# EAGLE design 2018_Dashboard (EAGLE 8.6.1)
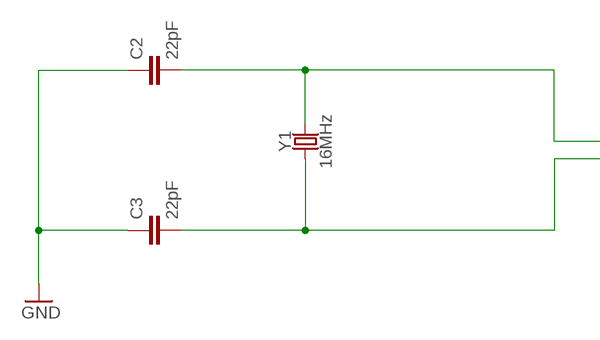
[diagram p0: schematic, sheet 1, part 1 of 2]
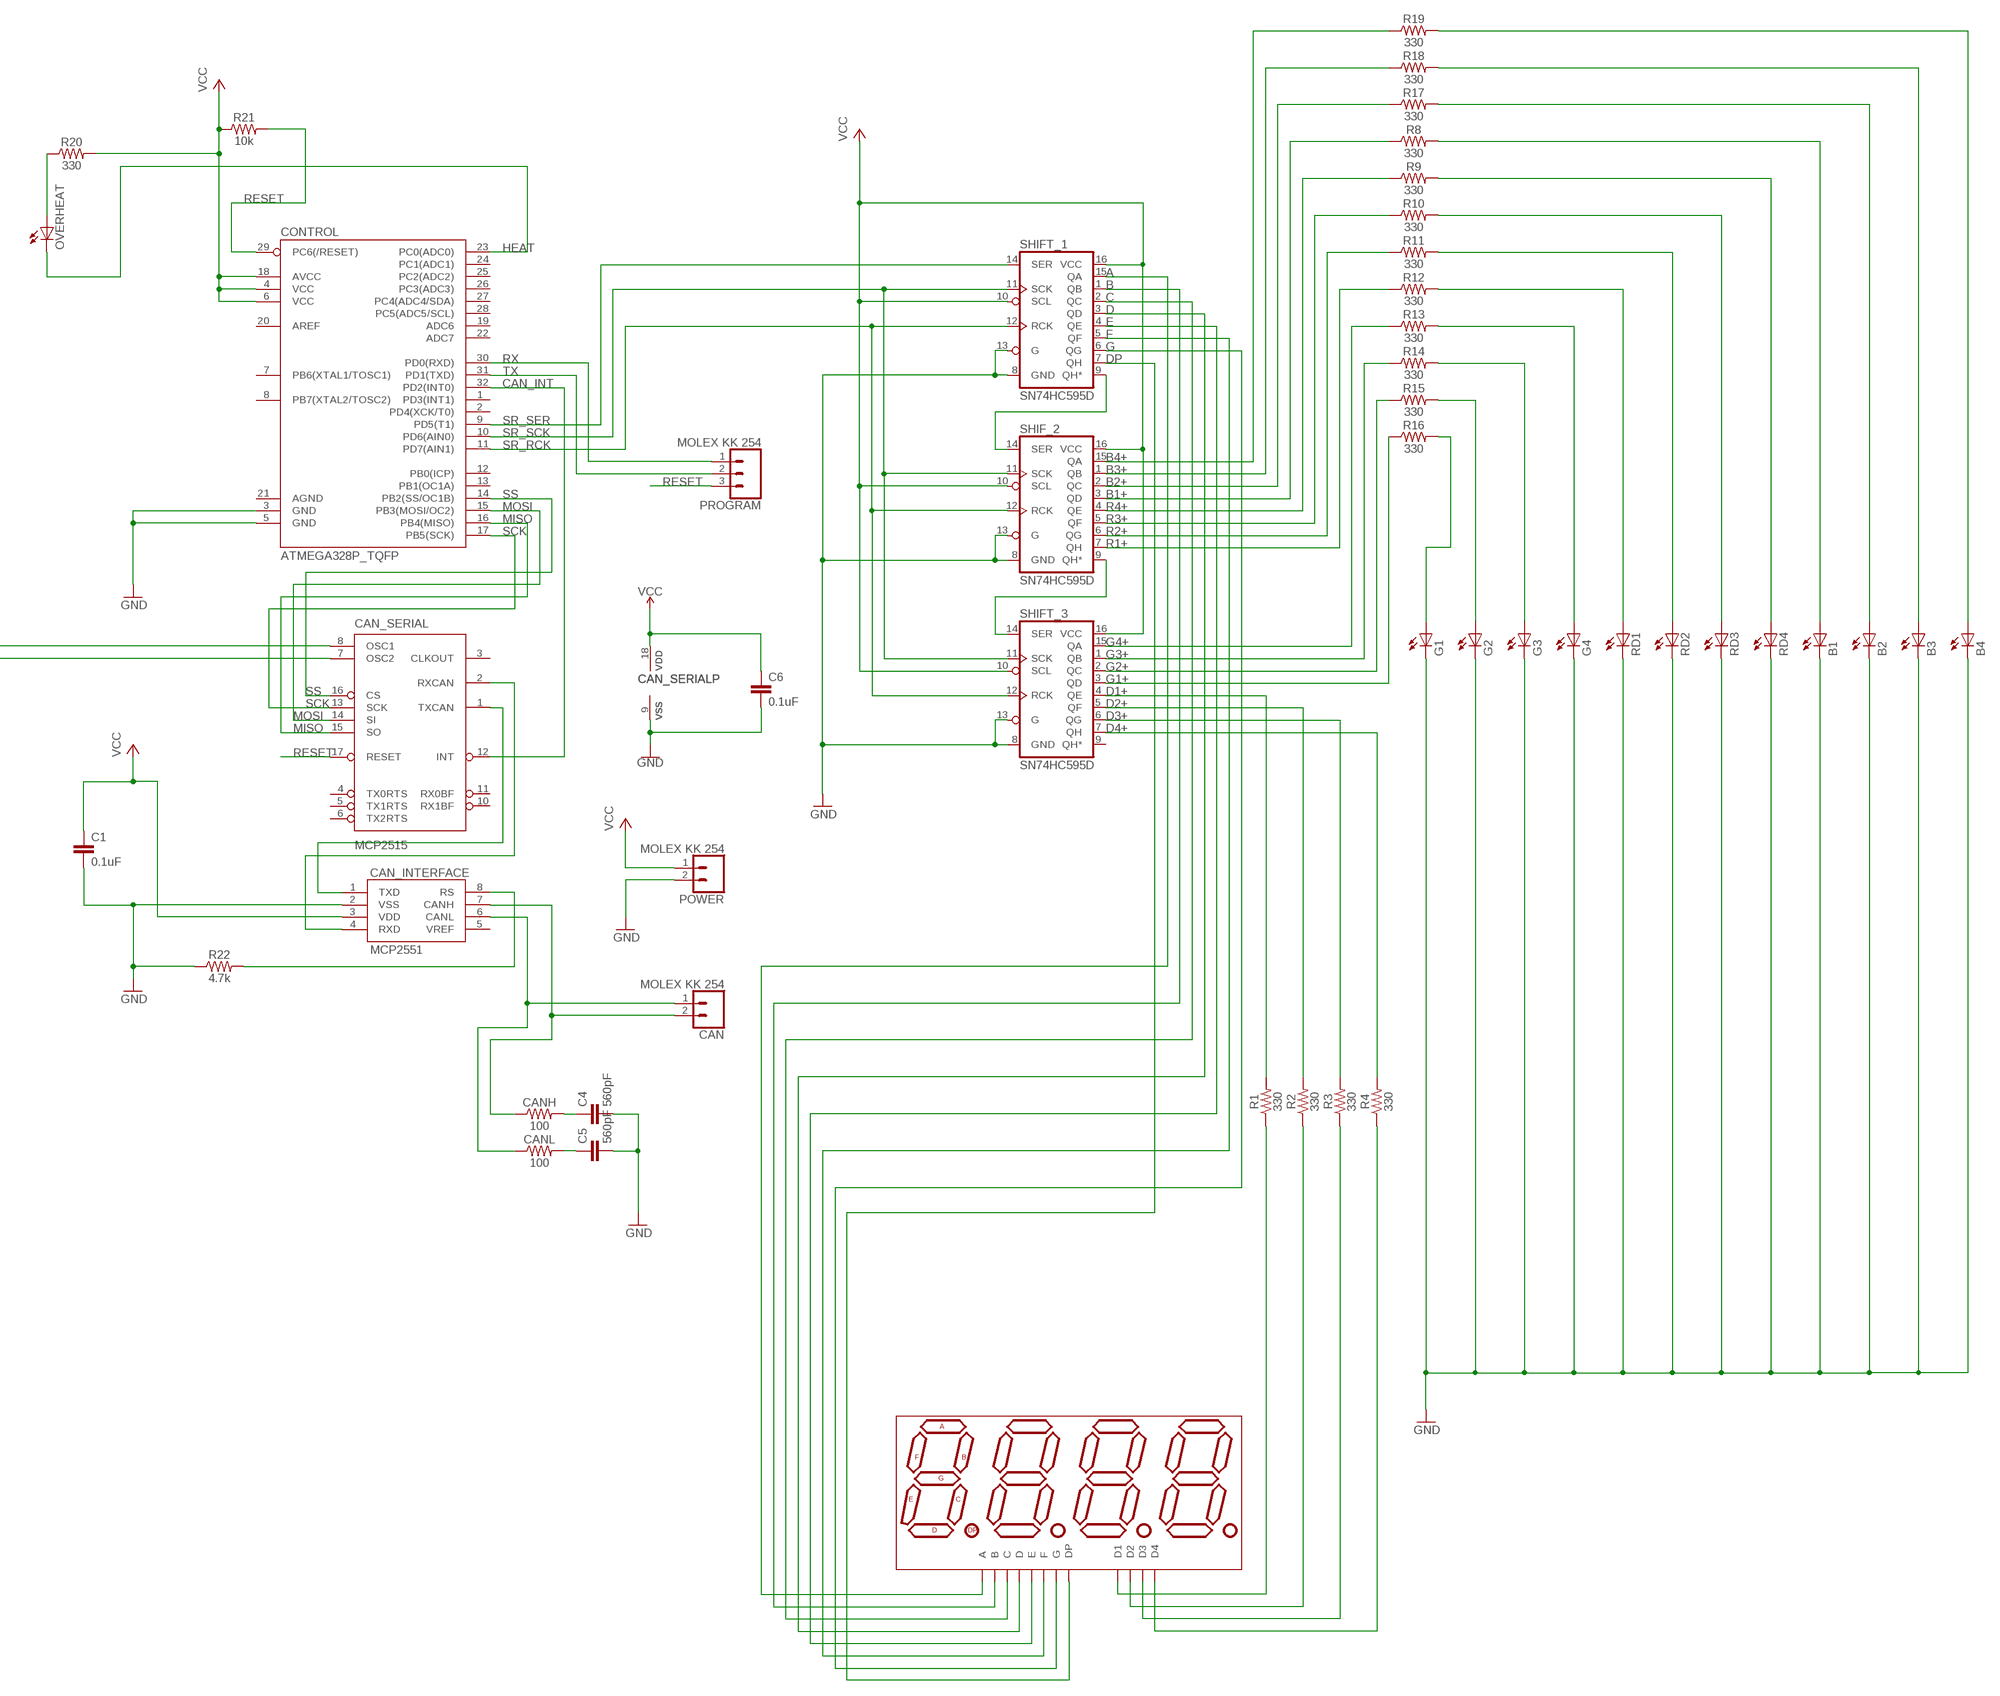
[diagram p1: schematic, sheet 1, part 2 of 2]

## Parts
B1  TLLG4400  [LED3MM]
B2  TLLG4400  [LED3MM]
B3  TLLG4400  [LED3MM]
B4  TLLG4400  [LED3MM]
C1  0.1uF  0.1UF-0603-25V-(+80/-20%)  [0603]
C2  22pF  22PF-0603-50V-5%  [0603]
C3  22pF  22PF-0603-50V-5%  [0603]
C4  560pF  560PF-0603-50V-5%  [0603]
C5  560pF  560PF-0603-50V-5%  [0603]
C6  0.1uF  0.1UF-0402-16V-10%  [0402]
CAN  MOLEX KK 254  CONN_02  [1X02]
CAN_INTERFACE  MCP2551  [SO08]
CAN_SERIAL  MCP2515  MCP2515(MCP2510)SO  [SO18W]
CANH  100  100OHM-0603-1/4W-5%  [0603]
CANL  100  100OHM-0603-1/4W-5%  [0603]
CONTROL  ATMEGA328P_TQFP  [TQFP32-08]
G1  TLLG4400  [LED3MM]
G2  TLLG4400  [LED3MM]
G3  TLLG4400  [LED3MM]
G4  TLLG4400  [LED3MM]
OVERHEAT  TLLG4400  [LED3MM]
POWER  MOLEX KK 254  CONN_02  [1X02]
PROGRAM  MOLEX KK 254  CONN_03  [1X03]
R1  330  330OHM-0603-1/10W-1%  [0603]
R2  330  330OHM-0603-1/10W-1%  [0603]
R3  330  330OHM-0603-1/10W-1%  [0603]
R4  330  330OHM-0603-1/10W-1%  [0603]
R8  330  330OHM-0603-1/10W-1%  [0603]
R9  330  330OHM-0603-1/10W-1%  [0603]
R10  330  330OHM-0603-1/10W-1%  [0603]
R11  330  330OHM-0603-1/10W-1%  [0603]
R12  330  330OHM-0603-1/10W-1%  [0603]
R13  330  330OHM-0603-1/10W-1%  [0603]
R14  330  330OHM-0603-1/10W-1%  [0603]
R15  330  330OHM-0603-1/10W-1%  [0603]
R16  330  330OHM-0603-1/10W-1%  [0603]
R17  330  330OHM-0603-1/10W-1%  [0603]
R18  330  330OHM-0603-1/10W-1%  [0603]
R19  330  330OHM-0603-1/10W-1%  [0603]
R20  330  330OHM-0603-1/10W-1%  [0603]
R21  10k  10KOHM-0603-1/10W-1%  [0603]
R22  4.7k  4.7KOHM-0603-1/10W-1%  [0603]
RD1  TLLG4400  [LED3MM]
RD2  TLLG4400  [LED3MM]
RD3  TLLG4400  [LED3MM]
RD4  TLLG4400  [LED3MM]
SEVEN_SEGMENT  ATA8041AB  7-SEGMENT-4DIGIT-20MM-BLUE  [7-SEGMENT-4DIGIT-20MM]
SHIF_2  SN74HC595D  74HC595D  [SO16]
SHIFT_1  SN74HC595D  74HC595D  [SO16]
SHIFT_3  SN74HC595D  74HC595D  [SO16]
Y1  16MHz  CRYSTAL-16MHZPTH-HC49US  [HC49US]

## Nets
A: SEVEN_SEGMENT.11(A) SHIFT_1.15(QA)
B: SEVEN_SEGMENT.7(B) SHIFT_1.1(QB)
B1: B1.A R8.2
B1+: R8.1 SHIF_2.3(QD)
B2: B2.A R17.2
B2+: R17.1 SHIF_2.2(QC)
B3: B3.A R18.2
B3+: R18.1 SHIF_2.1(QB)
B4: B4.A R19.2
B4+: R19.1 SHIF_2.15(QA)
C: SEVEN_SEGMENT.4(C) SHIFT_1.2(QC)
CAN_INT: CAN_SERIAL.12(INT) CONTROL.32(PD2(INT0))
CANH: CAN.2 CAN_INTERFACE.7(CANH) CANH.1
CANL: CAN.1 CAN_INTERFACE.6(CANL) CANL.1
CARRY1: SHIF_2.14(SER) SHIFT_1.9(QH*)
CARRY2: SHIF_2.9(QH*) SHIFT_3.14(SER)
CHI: C4.1 CANH.2
CI_SLOPE: CAN_INTERFACE.8(RS) R22.2
CLI: C5.1 CANL.2
D: SEVEN_SEGMENT.2(D) SHIFT_1.3(QD)
D1: R1.1 SEVEN_SEGMENT.12(D1)
D1+: R1.2 SHIFT_3.4(QE)
D2: R2.1 SEVEN_SEGMENT.9(D2)
D2+: R2.2 SHIFT_3.5(QF)
D3: R3.1 SEVEN_SEGMENT.8(D3)
D3+: R3.2 SHIFT_3.6(QG)
D4: R4.1 SEVEN_SEGMENT.6(D4)
D4+: R4.2 SHIFT_3.7(QH)
DP: SEVEN_SEGMENT.3(DP) SHIFT_1.7(QH)
E: SEVEN_SEGMENT.1(E) SHIFT_1.4(QE)
F: SEVEN_SEGMENT.10(F) SHIFT_1.5(QF)
G: SEVEN_SEGMENT.5(G) SHIFT_1.6(QG)
G1: G1.A R16.2
G1+: R16.1 SHIFT_3.3(QD)
G2: G2.A R15.2
G2+: R15.1 SHIFT_3.2(QC)
G3: G3.A R14.2
G3+: R14.1 SHIFT_3.1(QB)
G4: G4.A R13.2
G4+: R13.1 SHIFT_3.15(QA)
GND: B1.K(C) B2.K(C) B3.K(C) B4.K(C) C1.2 C2.1 C3.1 C4.2 C5.2 C6.2 CAN_INTERFACE.2(VSS) CAN_SERIAL.9(VSS) CONTROL.3(GND) CONTROL.5(GND) G1.K(C) G2.K(C) G3.K(C) G4.K(C) POWER.2 R22.1 RD1.K(C) RD2.K(C) RD3.K(C) RD4.K(C) SHIF_2.8(GND) SHIF_2.13(G) SHIFT_1.8(GND) SHIFT_1.13(G) SHIFT_3.8(GND) SHIFT_3.13(G)
HEAT: CONTROL.23(PC0(ADC0)) OVERHEAT.K(C)
HEAT+: OVERHEAT.A R20.1
MISO: CAN_SERIAL.15(SO) CONTROL.16(PB4(MISO))
MOSI: CAN_SERIAL.14(SI) CONTROL.15(PB3(MOSI/OC2))
N$57: CAN_INTERFACE.1(TXD) CAN_SERIAL.1(TXCAN)
N$58: CAN_INTERFACE.4(RXD) CAN_SERIAL.2(RXCAN)
OSC1: C2.2 CAN_SERIAL.8(OSC1) Y1.2
OSC2: C3.2 CAN_SERIAL.7(OSC2) Y1.1
R1: R12.2 RD1.A
R1+: R12.1 SHIF_2.7(QH)
R2: R11.2 RD2.A
R2+: R11.1 SHIF_2.6(QG)
R3: R10.2 RD3.A
R3+: R10.1 SHIF_2.5(QF)
R4: R9.2 RD4.A
R4+: R9.1 SHIF_2.4(QE)
RESET: CAN_SERIAL.17(RESET) CONTROL.29(PC6(/RESET)) PROGRAM.3 R21.2
RX: CONTROL.30(PD0(RXD)) PROGRAM.1
SCK: CAN_SERIAL.13(SCK) CONTROL.17(PB5(SCK))
SR_RCK: CONTROL.11(PD7(AIN1)) SHIF_2.12(RCK) SHIFT_1.12(RCK) SHIFT_3.12(RCK)
SR_SCK: CONTROL.10(PD6(AIN0)) SHIF_2.11(SCK) SHIFT_1.11(SCK) SHIFT_3.11(SCK)
SR_SER: CONTROL.9(PD5(T1)) SHIFT_1.14(SER)
SS: CAN_SERIAL.16(CS) CONTROL.14(PB2(SS/OC1B))
TX: CONTROL.31(PD1(TXD)) PROGRAM.2
VCC: C1.1 C6.1 CAN_INTERFACE.3(VDD) CAN_SERIAL.18(VDD) CONTROL.4(VCC) CONTROL.6(VCC) CONTROL.18(AVCC) POWER.1 R20.2 R21.1 SHIF_2.10(SCL) SHIF_2.16(VCC) SHIFT_1.10(SCL) SHIFT_1.16(VCC) SHIFT_3.10(SCL) SHIFT_3.16(VCC)
Unconnected: CAN_INTERFACE.5(VREF) CAN_SERIAL.3(CLKOUT) CAN_SERIAL.4(TX0RTS) CAN_SERIAL.5(TX1RTS) CAN_SERIAL.6(TX2RTS) CAN_SERIAL.10(RX1BF) CAN_SERIAL.11(RX0BF) CONTROL.1(PD3(INT1)) CONTROL.2(PD4(XCK/T0)) CONTROL.7(PB6(XTAL1/TOSC1)) CONTROL.8(PB7(XTAL2/TOSC2)) CONTROL.12(PB0(ICP)) CONTROL.13(PB1(OC1A)) CONTROL.19(ADC6) CONTROL.20(AREF) CONTROL.21(AGND) CONTROL.22(ADC7) CONTROL.24(PC1(ADC1)) CONTROL.25(PC2(ADC2)) CONTROL.26(PC3(ADC3)) CONTROL.27(PC4(ADC4/SDA)) CONTROL.28(PC5(ADC5/SCL)) SHIFT_3.9(QH*)

## Library data of the parts
B1-B4 G1-G4 OVERHEAT RD1-RD4 = led:TLLG4400: Low Current (2mA) LED 3 mm Tinted Diffused Package color GREEN Source: Data sheet <http://www.farnell.com/datasheets/391098.pdf>; MF: VISHAY SEMICONDUCTOR; OC_FARNELL: 1612435
C1 = SparkFun-Capacitors:0.1UF: 0.1µF ceramic capacitors A capacitor is a passive two-terminal electrical component used to store electrical energy temporarily in an electric field.; PROD_ID: CAP-00810
C2 C3 = SparkFun-Capacitors:22PF: 22pF ceramic capacitors A capacitor is a passive two-terminal electrical component used to store electrical energy temporarily in an electric field.; PROD_ID: CAP-07876
C4 C5 = SparkFun-Capacitors:560PF: 0.56nF/560pF ceramic capacitors A capacitor is a passive two-terminal electrical component used to store electrical energy temporarily in an electric field.; PROD_ID: CAP-08749
C6 = SparkFun-Capacitors:0.1UF: 0.1µF ceramic capacitors A capacitor is a passive two-terminal electrical component used to store electrical energy temporarily in an electric field.; PROD_ID: CAP-12416
CAN POWER = SparkFun-Connectors:CONN_02: Multi connection point. Often used as Generic Header-pin footprint for 0.1 inch spaced/style header connections On any of the 0.1 inch spaced packages, you can populate with these: Break Away Headers - Straight <https://www.sparkfun.com/products/116> (PRT-00116) Break Away Male Headers - Right Angle <https://www.sparkfun.com/products/553> (PRT-00553) Female Headers <https://www.sparkfun.com/products/115> (PRT-00115) Break Away Headers - Machine Pin <https://www.sparkfun.com/products/117> (PRT-00117) Break Away Female Headers - Swiss Machine Pin <https://www.sparkfun.com/products/743> (PRT-00743) For SCREWTERMINALS and SPRING TERMINALS visit here: Screw Terimnals on SparkFun.com <https://www.sparkfun.com/search/results?term=Screw+Terminals> (5mm/3.5mm/2.54mm spacing) This device is also useful as a general connection point to wire up your design to another part of your project. Our various solder wires solder well into these plated through hole pads. Hook-Up Wire - Assortment (Stranded, 22 AWG) <https://www.sparkfun.com/products/11375> (PRT-11375) Hook-Up Wire - Assortment (Solid Core, 22 AWG) <https://www.sparkfun.com/products/11367> (PRT-11367) View the entire wire category on our website here <https://www.sparkfun.com/categories/141> Special notes: Molex polarized connector foot print use with: PRT-08233 with associated crimp pins and housings. 2.54_SCREWTERM for use with PRT-10571. 3.5mm Screw Terminal footprints for PRT-08084 5mm Screw Terminal footprints for use with PRT-08432
CAN_INTERFACE = SparkFun-IC-Comms:MCP2551: MCP2551 High Speed CAN Transceiver High speed CAN transceiver Datasheet <http://www.sparkfun.com/datasheets/DevTools/Arduino/MCP2551.pdf> SparkFun Products CAN-BUS Shield <https://www.sparkfun.com/products/13262> (DEV-13262) SparkFun OBD-II UART <https://www.sparkfun.com/products/9555> (WIG-09555); PROD_ID: IC-09907
CAN_SERIAL = SparkFun-IC-Comms:MCP2515(MCP2510): CAN controller with SPI interface The MCP2515 controller supercedes the MCP2510 while addressing all errata associated with it. The two devices are pin compatible, either can be used with this device. 18-pin package SOIC Simple SPI interface to any MCU. One-shot mode ensures message transmission is attempted only once Databyte filtering Start-of-Frame (SOF) output Low-power CMOS Technology Datasheet <http://www.sparkfun.com/datasheets/DevTools/Arduino/MCP2515.pdf> SparkFun Products CAN-BUS Shield <https://www.sparkfun.com/products/13262> (DEV-13262); PROD_ID: IC-09906
CANH CANL = SparkFun-Resistors:100OHM: 100Ω resistor A resistor is a passive two-terminal electrical component that implements electrical resistance as a circuit element. Resistors act to reduce current flow, and, at the same time, act to lower voltage levels within circuits. - Wikipedia; PROD_ID: RES-12438
CONTROL = SparkFun-IC-Microcontroller:ATMEGA328P_TQFP: Popular 328P in QFP Storefront component: ATmega328 - TQFP <https://www.sparkfun.com/products/13448> (COM-13448) Datasheet <http://www.sparkfun.com/datasheets/Components/SMD/ATMega328.pdf> SparkFun Products SparkFun RedBoard - Programmed with Arduino <https://www.sparkfun.com/products/12757> (DEV-12757) Arduino Pro Mini 328 - 5V/16MHz <https://www.sparkfun.com/products/11113> (DEV-11113) Arduino Pro Mini 328 - 3.3V/8MHz <https://www.sparkfun.com/products/11114> (DEV-11114) SparkFun OpenLog <https://www.sparkfun.com/products/13712> (DEV-13712) SparkFun MicroView - OLED Arduino Module <https://www.sparkfun.com/products/12923> (DEV-12923) SparkFun Digital Sandbox <https://www.sparkfun.com/products/12651> (DEV-12651) SparkFun PicoBoard <https://www.sparkfun.com/products/11888> (WIG-11888) Arduino Fio <https://www.sparkfun.com/products/10116> (DEV-10116) LilyPad Arduino 328 Main Board <https://www.sparkfun.com/products/13342> (DEV-13342) SparkFun RedStick <https://www.sparkfun.com/products/13741> (DEV-13741) LilyPad MP3 <https://www.sparkfun.com/products/11013> (DEV-11013) LilyPad Arduino SimpleSnap <https://www.sparkfun.com/products/10941> (DEV-10941) SparkFun Stepoko <https://www.sparkfun.com/products/13899> (ROB-13899) SparkFun Geiger Counter <https://www.sparkfun.com/products/11345> (SEN-11345) SparkFun EL Sequencer <https://www.sparkfun.com/products/12781> (COM-12781) Arduino Pro 328 - 5V/16MHz <https://www.sparkfun.com/products/10915> (DEV-10915) CryptoCape <https://www.sparkfun.com/products/12773> (DEV-12773) SparkFun IR Thermometer Evaluation Board - MLX90614 <https://www.sparkfun.com/products/10740> (SEN-10740) SparkFun RedBot Mainboard <https://www.sparkfun.com/products/12097> (ROB-12097) Arduino Pro 328 - 3.3V/8MHz <https://www.sparkfun.com/products/10914> (DEV-10914) SparkFun Block for Intel® Edison - Arduino <https://www.sparkfun.com/products/13036> (DEV-13036) SparkFun Simon Says - Surface Mount Soldering Kit <https://www.sparkfun.com/products/10935> (KIT-10935) SparkFun 7-Segment Serial Display - Red <https://www.sparkfun.com/products/11441> (COM-11441) SparkFun 7-Segment Serial Display - White <https://www.sparkfun.com/products/11629> (COM-11629) SparkFun 7-Segment Serial Display - Yellow <https://www.sparkfun.com/products/11443> (COM-11443) SparkFun 7-Segment Serial Display - Kelly Green <https://www.sparkfun.com/products/11440> (COM-11440) SparkFun 7-Segment Serial Display - Blue <https://www.sparkfun.com/products/11442> (COM-11442) SparkFun OpenSegment Serial Display - 20mm (Blue) <https://www.sparkfun.com/products/11647> (COM-11647) SparkFun OpenSegment Serial Display - 20mm (Green) <https://www.sparkfun.com/products/11646> (COM-11646) SparkFun OpenSegment Serial Display - 20mm (White) <https://www.sparkfun.com/products/11648> (COM-11648) SparkFun OpenSegment Serial Display - 20mm (Red) <https://www.sparkfun.com/products/11644> (COM-11644) SparkFun OpenSegment Serial Display - 20mm (Yellow) <https://www.sparkfun.com/products/11645> (COM-11645) SparkFun OpenSegment Shield <https://www.sparkfun.com/products/13190> (DEV-13190); PROD_ID: IC-09069
PROGRAM = SparkFun-Connectors:CONN_03: Multi connection point. Often used as Generic Header-pin footprint for 0.1 inch spaced/style header connections On any of the 0.1 inch spaced packages, you can populate with these: Break Away Headers - Straight <https://www.sparkfun.com/products/116> (PRT-00116) Break Away Male Headers - Right Angle <https://www.sparkfun.com/products/553> (PRT-00553) Female Headers <https://www.sparkfun.com/products/115> (PRT-00115) Break Away Headers - Machine Pin <https://www.sparkfun.com/products/117> (PRT-00117) Break Away Female Headers - Swiss Machine Pin <https://www.sparkfun.com/products/743> (PRT-00743) Stackable Header - 3 Pin (Female, 0.1") <https://www.sparkfun.com/products/13875> (PRT-13875) For SCREWTERMINALS and SPRING TERMINALS visit here: Screw Terimnals on SparkFun.com <https://www.sparkfun.com/search/results?term=Screw+Terminals> (5mm/3.5mm/2.54mm spacing) This device is also useful as a general connection point to wire up your design to another part of your project. Our various solder wires solder well into these plated through hole pads. Hook-Up Wire - Assortment (Stranded, 22 AWG) <https://www.sparkfun.com/products/11375> (PRT-11375) Hook-Up Wire - Assortment (Solid Core, 22 AWG) <https://www.sparkfun.com/products/11367> (PRT-11367) View the entire wire category on our website here <https://www.sparkfun.com/categories/141> Special notes: Molex polarized connector foot print use with SKU : PRT-08232 with associated crimp pins and housings.; PROD_ID: XXX-00000; VALUE: 455-1750-1-ND
R1-R4 R8-R20 = SparkFun-Resistors:330OHM: 330Ω resistor A resistor is a passive two-terminal electrical component that implements electrical resistance as a circuit element. Resistors act to reduce current flow, and, at the same time, act to lower voltage levels within circuits. - Wikipedia; PROD_ID: RES-00818
R21 = SparkFun-Resistors:10KOHM: 10kΩ resistor A resistor is a passive two-terminal electrical component that implements electrical resistance as a circuit element. Resistors act to reduce current flow, and, at the same time, act to lower voltage levels within circuits. - Wikipedia; PROD_ID: RES-00824
R22 = SparkFun-Resistors:4.7KOHM: 4.7kΩ resistor A resistor is a passive two-terminal electrical component that implements electrical resistance as a circuit element. Resistors act to reduce current flow, and, at the same time, act to lower voltage levels within circuits. - Wikipedia; PROD_ID: RES-07857
SEVEN_SEGMENT = SparkFun-LED:7-SEGMENT-4DIGIT-20MM: 4 Digit 7 Segment Display This is a part for the 4-Digit 7-segment LEDs from Young Sun. Different from the Digikey LEDs, all 16 pins are used. The LONGPADS Variant is used for a test jig, but you may like it because there is more pad to solder to. If you are concerned about routing space, the standard works just fine though. Datasheets: Red <http://cdn.sparkfun.com/datasheets/Components/LED/1LEDREDCC.pdf> Yellow <http://cdn.sparkfun.com/datasheets/Components/LED/1LEDYELCC.pdf> Green <http://cdn.sparkfun.com/datasheets/Components/LED/1LEDGRNCC.pdf> Blue <http://cdn.sparkfun.com/datasheets/Components/LED/1LEDBLUCC.pdf> White <http://cdn.sparkfun.com/datasheets/Components/LED/1LEDWHTCC.pdf> SparkFun Products Raw Components 7-Segment Display - 20mm (Red) <https://www.sparkfun.com/products/11405> (COM-11405) 7-Segment Display - 20mm (Yellow) <https://www.sparkfun.com/products/11406> (COM-11406) 7-Segment Display - 20mm (Green) <https://www.sparkfun.com/products/11407> (COM-11407) 7-Segment Display - 20mm (Blue) <https://www.sparkfun.com/products/11408> (COM-11408) 7-Segment Display - 20mm (White) <https://www.sparkfun.com/products/11409> (COM-11409) Serial Controlled SparkFun OpenSegment Serial Display - 20mm (Red) <https://www.sparkfun.com/products/11644> (COM-11644) SparkFun OpenSegment Serial Display - 20mm (Yellow) <https://www.sparkfun.com/products/11645> (COM-11645) SparkFun OpenSegment Serial Display - 20mm (Green) <https://www.sparkfun.com/products/11646> (COM-11646) SparkFun OpenSegment Serial Display - 20mm (Blue) <https://www.sparkfun.com/products/11647> (COM-11647) SparkFun OpenSegment Serial Display - 20mm (White) <https://www.sparkfun.com/products/11648> (COM-11648) Other SparkFun OpenSegment Shield <https://www.sparkfun.com/products/13190> (DEV-13190); PROD_ID: COMP-11446
SHIF_2 SHIFT_1 SHIFT_3 = SparkFun-IC-Logic:74*595: 8-Bit Shift Register (Serial to Parallel) Datasheet <http://cdn.sparkfun.com/datasheets/BreakoutBoards/MM74HC595.pdf> SparkFun Products SparkFun Shift Register Breakout - 74HC595 <https://www.sparkfun.com/products/10680> (BOB-10680); PROD_ID: IC-07875
Y1 = SparkFun-Clocks:CRYSTAL-16MHZ: 16MHz Crystal Digikey Example <http://www.digikey.com/product-search/en?keywords=535-9122-1-ND> Frequency: 16MHz Frequency Stability: ±50ppm Frequency Tolerance: ±20ppm Load Capacitance: 18pF SparkFun Products: Pro Micro -5V/16MHz <https://www.sparkfun.com/products/12640> SparkFun Serial Enabled LCD Kit <https://www.sparkfun.com/products/10097>; PROD_ID: XTAL-08181; SF_ID: COM-00536

## Board
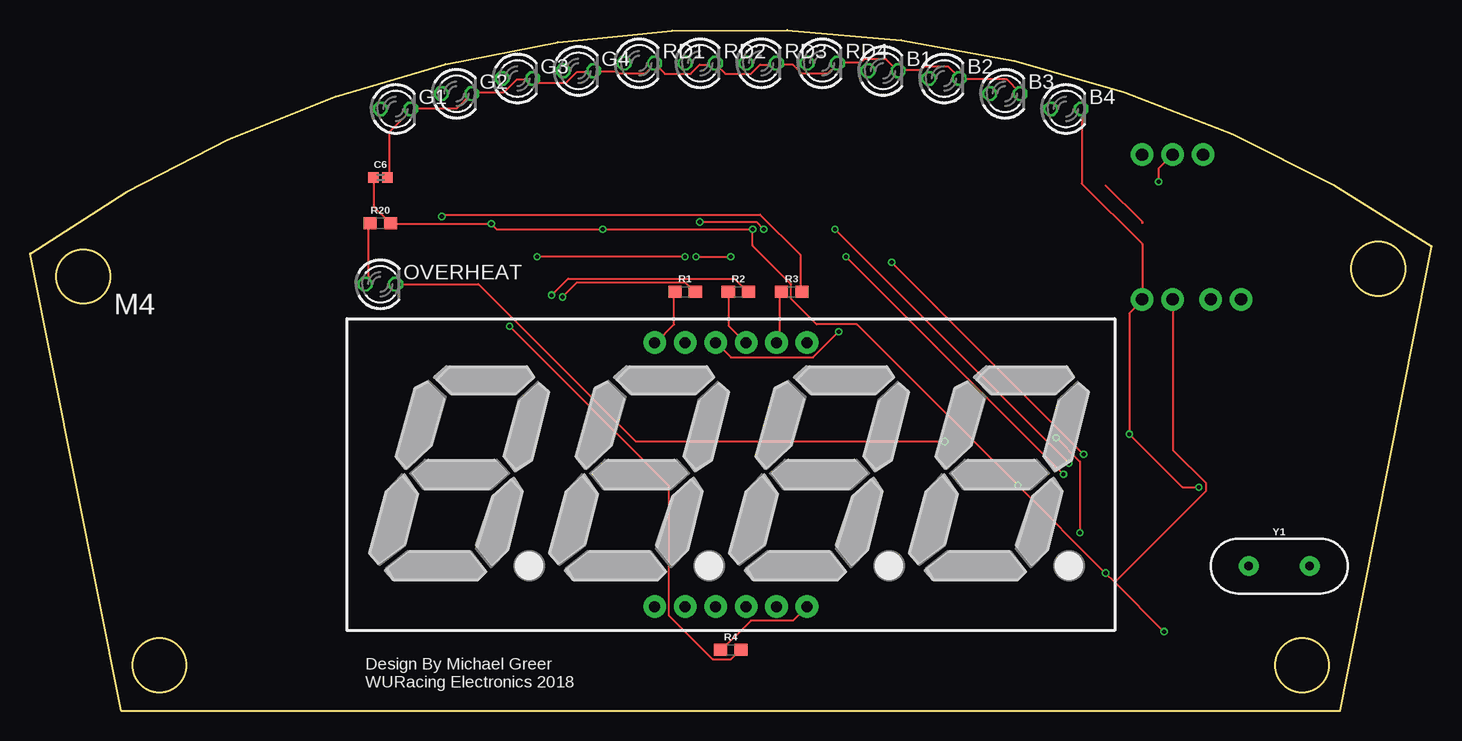
[diagram p2: board, top side]
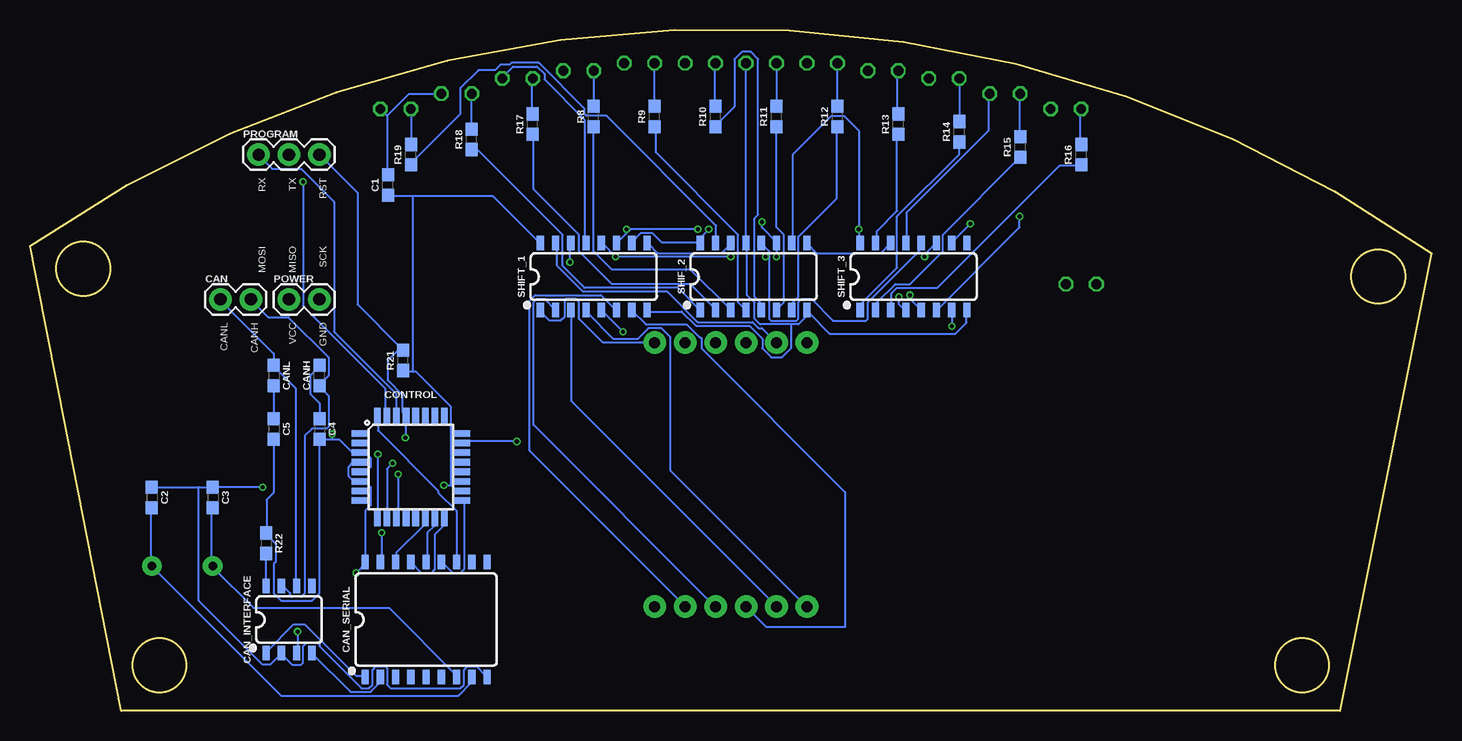
[diagram p3: board, bottom side, seen from below]

Size 116.84 x 56.74 mm. Coordinates in mm from the lower left corner, seen from the top.
Outline: 7.62,0 109.22,0 116.84,38.73 arc70 0,38.1 7.62,0
Outline: circle at 4.45,36.2 radius 2.25
Outline: circle at 112.4,36.83 radius 2.25
Outline: circle at 10.8,3.81 radius 2.25
Outline: circle at 106.05,3.81 radius 2.25
Copper layers (1*16): Top 0.035559375mm / dielectric 1.6mm / Bottom 0.035559375mm
Design rules "oshpark-2layer": minimum track width 6mil, minimum drill 10mil, track to track 6mil, track to pad 6mil, pad to pad 6mil, via to via 6mil, smd to smd 6mil, copper to edge 15mil, drill to drill 6mil, minimum pad ring 5mil, minimum via ring 5mil, stop-mask expansion 2.5mil, vias tented up to drill 0mil, thermal gap 10mil

### Footprints (pad centres in the part's own frame; a part is rotated, then mirrored left to right if it is on the bottom)
LED3MM = drill 0.813 octagon: A -1.27,0; K 1.27,0
0603 = smd 1.1 x 1: 1 -0.85,0; 2 0.85,0
0402 = smd 0.85 x 0.9: 1 -0.58,0; 2 0.58,0
1X02 = drill 1.016 pad 1.88: 1 0,0; 2 2.54,0
SO08 = smd 0.6 x 1.2: 1 -1.905,-2.8; 2 -0.635,-2.8; 3 0.635,-2.8; 4 1.905,-2.8; 5 1.905,2.8; 6 0.635,2.8; 7 -0.635,2.8; 8 -1.905,2.8
SO18W = smd 0.6 x 1.2: 1 -5.08,-4.788; 2 -3.81,-4.788; 3 -2.54,-4.788; 4 -1.27,-4.788; 5 0,-4.788; 6 1.27,-4.788; 7 2.54,-4.788; 8 3.81,-4.788; 9 5.08,-4.788; 10 5.08,4.788; 11 3.81,4.788; 12 2.54,4.788; 13 1.27,4.788; 14 0,4.788; 15 -1.27,4.788; 16 -2.54,4.788; 17 -3.81,4.788; 18 -5.08,4.788
TQFP32-08 = smd 1.27 x 0.559: 1 -4.293,2.8; 2 -4.293,2; 3 -4.293,1.2; 4 -4.293,0.4; 5 -4.293,-0.4; 6 -4.293,-1.2; 7 -4.293,-2; 8 -4.293,-2.8; 17 4.293,-2.8; 18 4.293,-2; 19 4.293,-1.2; 20 4.293,-0.4; 21 4.293,0.4; 22 4.293,1.2; 23 4.293,2; 24 4.293,2.8 | smd 0.559 x 1.27: 9 -2.8,-4.293; 10 -2,-4.293; 11 -1.2,-4.293; 12 -0.4,-4.293; 13 0.4,-4.293; 14 1.2,-4.293; 15 2,-4.293; 16 2.8,-4.293; 25 2.8,4.293; 26 2,4.293; 27 1.2,4.293; 28 0.4,4.293; 29 -0.4,4.293; 30 -1.2,4.293; 31 -2,4.293; 32 -2.8,4.293
1X03 = drill 1.016 pad 1.88: 1 0,0; 2 2.54,0; 3 5.08,0
7-SEGMENT-4DIGIT-20MM = drill 0.9 pad 1.88: 1 -6.35,-10.998; 2 -3.81,-10.998; 3 -1.27,-10.998; 4 1.27,-10.998; 5 3.81,-10.998; 6 6.35,-10.998; 7 6.35,10.998; 8 3.81,10.998; 9 1.27,10.998; 10 -1.27,10.998; 11 -3.81,10.998; 12 -6.35,10.998
SO16 = smd 0.6 x 1.2: 1 -4.445,-2.8; 2 -3.175,-2.8; 3 -1.905,-2.8; 4 -0.635,-2.8; 5 0.635,-2.8; 6 1.905,-2.8; 7 3.175,-2.8; 8 4.445,-2.8; 9 4.445,2.8; 10 3.175,2.8; 11 1.905,2.8; 12 0.635,2.8; 13 -0.635,2.8; 14 -1.905,2.8; 15 -3.175,2.8; 16 -4.445,2.8
HC49US = drill 0.7 pad 1.651: 1 -2.54,0; 2 2.54,0

### Placement (x,y rotation side)
B1  71.12,53.34 0 top
B2  76.2,52.7 0 top
B3  81.28,51.44 0 top
B4  86.36,50.16 0 top
C1  87,43.81 90 bottom
C2  106.68,17.78 270 bottom
C3  101.6,17.78 270 bottom
C4  92.71,23.49 270 bottom
C5  96.52,23.49 270 bottom
C6  29.21,44.45 0 top
CAN  100.97,34.29 0 bottom
CAN_INTERFACE  95.25,7.62 0 bottom
CAN_SERIAL  83.82,7.62 0 bottom
CANH  92.71,27.94 90 bottom
CANL  96.52,27.94 270 bottom
CONTROL  85.09,20.32 0 bottom
G1  30.48,50.16 0 top
G2  35.56,51.44 0 top
G3  40.64,52.7 0 top
G4  45.72,53.34 0 top
OVERHEAT  29.21,35.56 0 top
POWER  95.25,34.29 0 bottom
PROGRAM  97.79,46.36 0 bottom
R1  54.61,34.92 0 top
R2  59.06,34.92 0 top
R3  63.5,34.92 0 top
R4  58.42,5.08 0 top
R8  69.85,49.53 90 bottom
R9  64.77,49.53 90 bottom
R10  59.69,49.53 90 bottom
R11  54.61,49.53 90 bottom
R12  49.53,49.53 90 bottom
R13  44.45,48.89 90 bottom
R14  39.37,48.26 90 bottom
R15  34.29,46.99 90 bottom
R16  29.21,46.36 90 bottom
R17  74.93,48.89 90 bottom
R18  80.01,47.62 90 bottom
R19  85.09,46.36 90 bottom
R20  29.21,40.64 0 top
R21  85.73,29.21 90 bottom
R22  97.16,13.97 270 bottom
RD1  50.8,53.97 0 top
RD2  55.88,53.97 0 top
RD3  60.96,53.97 0 top
RD4  66.04,53.97 0 top
SEVEN_SEGMENT  58.42,19.69 0 top
SHIF_2  56.52,36.2 0 bottom
SHIFT_1  69.85,36.2 0 bottom
SHIFT_3  43.18,36.2 0 bottom
Y1  104.14,12.06 0 top

### Tracks (layer width: path | path; a pad name or v marks a point on that pad's centre or on a via)
A
  Bottom 0.152: SEVEN_SEGMENT.11 55.78,31.85 55.83,31.9 56.11,31.9 56.59,32.38 61.19,32.38 63.75,34.95 70.76,34.95 72.9,37.08 72.9,38.91 SHIFT_1.15
B
  Bottom 0.152: SEVEN_SEGMENT.7 69.09,30.68 71.07,32.66 71.07,34.04 71.37,34.34 72.14,34.34 72.29,34.19 72.29,32.82 72.59,32.51 73.51,32.51 74.27,33.27 SHIFT_1.1
B1
  Bottom 0.152: B1.A R8.2
B1+
  Bottom 0.152: R8.1 69.85,38.3 68.33,36.78 61.77,36.78 58.42,33.43 SHIF_2.3
B2
  Bottom 0.152: R17.2 75.03,49.89 75.03,52.63 B2.A
B2+
  Bottom 0.152: R17.1 74.88,47.9 74.88,43.48 71.07,39.67 71.07,38.3 68.33,35.56 61.77,35.56 59.64,33.43 SHIF_2.2
B3
  Bottom 0.152: R18.2 80.06,48.51 80.06,51.41 B3.A
B3+
  Bottom 0.152: R18.1 79.91,46.69 79.45,46.69 72.44,39.67 72.44,37.08 70.61,35.25 62.84,35.25 61.01,33.43 SHIF_2.1
B4
  Bottom 0.152: B4.A R19.2
B4+
  Bottom 0.152: R19.1 85.09,45.62 80.98,49.73 80.98,51.87 79.45,53.39 78.08,53.39 77.62,53.85 76.86,53.85 76.71,54 74.42,54 70.61,50.19 70.61,49.73 70.46,49.58 68.78,49.58 59.64,40.44 59.64,39.06 SHIF_2.15
C
  Bottom 0.152: SHIFT_1.2 73.05,33.43 73.97,34.34 74.57,34.34 74.88,34.04 74.88,23.82 59.79,8.74 SEVEN_SEGMENT.4
CAN_INT
  Bottom 0.152: CAN_SERIAL.12 81.28,16.66 82.8,18.19 82.8,18.34 87.83,23.37 87.83,24.59 CONTROL.32
CANH
  Bottom 0.152: CAN.2 98.35,34.19 96.98,32.82 95.3,32.82 91.95,29.46 91.95,27.94 92.71,27.18 CANH.1 92.71,27.03 91.95,26.26 91.95,23.67 92.1,23.52 93.32,23.52 93.93,22.91 93.93,9.8 94.23,9.5 95,9.5 95.15,9.65 95.15,9.8 95.76,10.41 CAN_INTERFACE.7
CANL
  Bottom 0.152: CAN.1 100.94,34.19 96.52,29.77 CANL.1 96.52,28.7 94.69,26.87 94.69,10.57 CAN_INTERFACE.6
CARRY1
  Bottom 0.152: SHIF_2.14 58.42,38.91 59.18,38.15 64.52,38.15 65.28,38.91 SHIFT_1.9
CARRY2
  Bottom 0.152: SHIFT_3.14 45.16,38.91 45.92,38.15 51.26,38.15 52.02,38.91 SHIF_2.9
CHI
  Bottom 0.152: C4.1 92.71,25.65 93.47,26.42 93.47,27.94 92.71,28.7 CANH.2
CI_SLOPE
  Bottom 0.152: CAN_INTERFACE.8 R22.2
CLI
  Bottom 0.152: CANL.2 C5.1
D
  Bottom 0.152: SHIFT_1.3 71.68,33.27 71.68,25.81 54.61,8.74 SEVEN_SEGMENT.2
D1
  Top 0.152: R1.1 53.7,34.8 53.7,32.21 52.17,30.68 SEVEN_SEGMENT.12
D1+  (via drill 0.35)
  Top 0.152: v44.4,34.49 45.62,35.71 54.61,35.71 55.37,34.95 R1.2
  Bottom 0.152: v44.4,34.49 44.4,33.88 43.94,33.43 SHIFT_3.4
D2
  Top 0.152: R2.1 58.27,34.8 58.27,32.05 59.64,30.68 SEVEN_SEGMENT.9
D2+  (via drill 0.35)
  Top 0.152: v43.48,34.65 44.86,36.02 58.73,36.02 59.79,34.95 R2.2
  Bottom 0.152: v43.48,34.65 43.48,34.34 42.57,33.43 SHIFT_3.5
D3
  Top 0.152: SEVEN_SEGMENT.8 62.53,30.99 62.53,34.8 R3.1
D3+  (via drill 0.35)
  Top 0.152: v34.34,41.2 34.49,41.35 60.86,41.35 64.21,38 64.21,34.95 R3.2
  Bottom 0.152: v34.34,41.2 34.34,40.28 41.2,33.43 SHIFT_3.6
D4
  Top 0.152: SEVEN_SEGMENT.6 63.6,7.52 60.1,7.52 57.66,5.08 R4.1
D4+  (via drill 0.35)
  Top 0.152: v39.98,32.05 53.24,18.8 53.24,7.98 56.9,4.32 58.42,4.32 59.18,5.08 R4.2
  Bottom 0.152: v39.98,32.05 39.98,33.27 SHIFT_3.7
DP
  Bottom 0.152: SHIFT_1.7 65.49,32.21 62.1,32.21 61.01,31.12 60.96,31.12 60.86,31.01 60.86,30.2 48.89,18.24 48.89,6.98 55.45,6.98 SEVEN_SEGMENT.3
E
  Bottom 0.152: SHIFT_1.4 70.46,33.27 68.17,30.99 66.19,30.99 65.28,31.9 64.21,31.9 63.45,31.14 63.45,20.02 52.17,8.74 SEVEN_SEGMENT.1
F  (via drill 0.35)
  Top 0.152: v67.41,31.6 65.28,29.46 58.42,29.46 57.2,30.68 SEVEN_SEGMENT.10
  Bottom 0.152: v67.41,31.6 69.09,33.27 SHIFT_1.5
G
  Bottom 0.152: SHIFT_1.6 68.02,33.43 69.24,34.65 74.73,34.65 75.18,34.19 75.18,21.69 62.23,8.74 SEVEN_SEGMENT.5
G1
  Bottom 0.152: R16.2 29.31,47.3 29.31,50.04 G1.A
G1+
  Bottom 0.152: R16.1 29.31,45.47 30.99,45.47 41.2,35.25 44.55,35.25 45.01,34.8 45.01,33.43 SHIFT_3.3
G2
  Bottom 0.152: R15.2 34.34,47.9 34.34,51.41 G2.A
G2+
  Bottom 0.152: R15.1 34.34,46.08 40.74,39.67 40.74,38.3 43.48,35.56 44.7,35.56 46.23,34.04 46.23,33.43 SHIFT_3.2
G3
  Bottom 0.152: G3.A R14.2
G3+
  Bottom 0.152: R14.1 39.37,46.38 44.55,41.2 44.55,36.93 47.6,33.88 47.6,33.43 SHIFT_3.1
G4
  Bottom 0.152: R13.2 44.55,49.89 44.55,53.24 G4.A
G4+
  Bottom 0.152: R13.1 44.55,47.9 44.55,41.66 46.23,39.98 46.23,39.06 SHIFT_3.15
GND  (via drill 0.35)
  Top 0.152: 46.99,53.24 48.97,53.24 49.12,53.09 51.26,53.09 52.02,53.85 RD1.K 52.17,53.85 52.93,53.09 55.07,53.09 55.83,53.85 57.05,53.85 RD2.K 57.2,53.85 57.96,53.09 60.1,53.09 60.86,53.85 62.23,53.85 | C6.2 29.92,44.55 29.92,48.21 31.75,50.04 G1.K 31.75,50.19 35.56,50.19 36.78,51.41 G2.K 36.93,51.56 39.52,51.56 40.59,52.63 41.81,52.63 G3.K 41.96,52.63 42.27,52.32 44.7,52.32 45.62,53.24 46.99,53.24 | 46.99,53.24 G4.K | B4.K 87.68,50.04 87.68,43.94 92.71,38.91 POWER.2 92.71,34.19 91.64,33.12 v91.64,23.06 96.06,18.64 v97.43,18.64 | B3.K 82.5,51.56 81.43,52.63 77.47,52.63 B2.K 77.47,52.78 76.56,53.7 74.57,53.7 74.27,53.39 72.44,53.39 B1.K 72.29,53.39 71.37,54.3 69.55,54.3 69.24,54 67.41,54 RD4.K 67.26,53.85 66.5,53.09 64.36,53.09 63.6,53.85 62.23,53.85 | 62.23,53.85 RD3.K
  Bottom 0.152: 51.87,33.12 52.02,33.27 SHIF_2.8 51.87,33.12 | 51.87,33.12 50.19,31.45 39.67,31.45 38.76,32.36 38.76,33.27 SHIFT_3.8 | 53.39,32.21 52.78,32.21 51.87,33.12 | 53.39,32.21 55.98,32.21 56.44,32.66 56.44,34.04 57.05,34.65 57.05,38.91 SHIF_2.13 57.2,39.06 57.2,53.85 RD2.K | 53.39,32.21 53.39,30.23 54.15,29.46 55.04,29.46 55.78,30.2 55.78,31.01 56.84,32.08 61.31,32.08 62.51,33.27 65.28,33.27 SHIFT_1.8 | SHIFT_3.13 43.79,39.06 43.79,41.5 36.93,48.36 36.93,51.41 G2.K | 102.77,18.64 106.58,18.64 C2.1 | 102.77,18.64 101.7,18.64 C3.1 101.55,18.64 v97.43,18.64 | 95.91,4.77 95,3.86 94.23,3.86 94.08,4.01 94.08,5.38 93.78,5.69 92.86,5.69 92.71,5.54 92.71,5.38 89.2,1.88 88.59,1.88 88.29,2.18 88.29,3.4 87.99,3.71 87.22,3.71 87.07,3.56 87.07,2.18 86.77,1.88 80.98,1.88 80.67,2.18 80.67,3.4 80.37,3.71 79.6,3.71 78.84,2.95 CAN_SERIAL.9 | 102.77,18.64 102.77,9.2 97.43,3.86 96.83,3.86 95.91,4.77 | 95.91,4.77 CAN_INTERFACE.2 | SHIFT_1.13 70.61,39.06 70.61,49.28 73.97,52.63 73.97,53.09 74.57,53.7 76.56,53.7 77.47,52.78 B2.K | 91.64,22.61 91.03,22.61 89.97,21.54 89.51,21.54 CONTROL.3 89.36,21.39 88.75,21.39 88.44,21.08 88.44,20.32 88.75,20.02 89.36,20.02 CONTROL.5 | 91.64,22.61 92.71,22.61 | C5.2 96.52,18.19 97.13,17.58 97.13,14.83 R22.1 97.13,14.68 96.37,13.92 96.37,12.39 96.52,12.24 96.52,9.8 95.91,9.2 93.32,9.2 92.71,9.8 92.71,22.61 | 92.71,22.61 C4.2 | 87.07,49.58 87.07,44.7 C1.2 | 87.07,49.58 87.53,50.04 B4.K | 87.07,49.58 85.24,51.41 82.65,51.41 B3.K | v91.64,23.06 91.64,22.61
HEAT  (via drill 0.35)
  Top 0.152: v76.25,22.45 50.5,22.45 37.39,35.56 OVERHEAT.K
  Bottom 0.152: v76.25,22.45 80.67,22.45 CONTROL.23
HEAT+
  Top 0.152: OVERHEAT.A 28.25,35.87 28.25,40.59 R20.1
MISO
  Bottom 0.152: CONTROL.16 82.35,15.9 82.35,15.44 83.11,14.68 83.11,11.79 83.41,11.48 84.18,11.48 85.09,12.39 CAN_SERIAL.15
MOSI
  Bottom 0.152: 83.11,16.05 CONTROL.15 83.11,15.9 83.11,15.44 83.72,14.83 83.72,12.55 CAN_SERIAL.14
N$57
  Bottom 0.152: CAN_SERIAL.1 88.9,2.95 89.66,2.95 93.93,7.21 94.84,7.21 97.13,4.93 CAN_INTERFACE.1
N$58
  Bottom 0.152: CAN_SERIAL.2 87.68,2.79 87.68,2.34 88.44,1.57 90.12,1.57 93.32,4.77 CAN_INTERFACE.4
OSC1
  Bottom 0.152: C2.2 106.73,16.81 106.73,12.09 Y1.2 106.58,11.94 95.91,1.27 81.13,1.27 80.06,2.34 80.06,2.79 CAN_SERIAL.8
OSC2
  Bottom 0.152: C3.2 101.7,16.81 101.7,12.09 Y1.1 101.55,11.94 98.2,8.58 86.92,8.58 81.28,2.95 CAN_SERIAL.7
R1
  Bottom 0.152: R12.2 49.58,50.5 49.58,53.85 RD1.A
R1+
  Bottom 0.152: R12.1 49.58,48.67 49.58,42.72 52.78,39.52 52.78,34.49 53.24,34.04 53.24,33.43 SHIF_2.7
R2
  Bottom 0.152: RD2.A R11.2
R2+
  Bottom 0.152: R11.1 54.61,40.28 54,39.67 54,34.04 54.61,33.43 SHIF_2.6
R3
  Bottom 0.152: R10.2 59.79,50.5 59.79,53.85 RD3.A
R3+
  Bottom 0.152: R10.1 59.64,48.82 58.11,50.34 58.11,54.3 57.51,54.91 56.74,54.91 56.13,54.3 56.13,41.35 56.44,41.05 56.44,34.49 55.98,34.04 55.98,33.43 SHIF_2.5
R4
  Bottom 0.152: R9.2 64.82,50.5 64.82,53.85 RD4.A
R4+
  Bottom 0.152: R9.1 64.67,48.67 64.67,46.53 57.81,39.67 57.81,34.04 57.2,33.43 SHIF_2.4
RESET  (via drill 0.35)
  Top 0.152: v87.53,14.83 87.53,20.78 v85.55,22.76
  Bottom 0.152: v87.53,14.83 87.53,12.55 CAN_SERIAL.17 | v85.55,22.76 85.55,24.59 CONTROL.29 85.78,24.91 85.78,26.32 87,27.53 87,29.21 85.94,30.27 | PROGRAM.3 89.54,43.18 89.54,33.87 85.94,30.27 | 85.94,30.27 R21.2
RX
  Bottom 0.152: CONTROL.30 86.31,24.74 86.31,26.42 91.49,31.6 91.49,42.42 94.23,45.16 96.67,45.16 97.74,46.23 PROGRAM.1
S$1
  Top 0.152: 92.71,40.64 92.71,40.74 89.66,43.79
SCK
  Bottom 0.152: CAN_SERIAL.13 82.5,12.39 81.59,11.48 80.98,11.48 80.67,11.79 80.67,17.42 CONTROL.17 80.67,17.58 80.21,17.58
SR_RCK  (via drill 0.35)
  Top 0.152: v55.52,37.85 v58.42,37.85 | v68.02,37.85 v86.16,19.71
  Bottom 0.152: 55.22,37.85 55.22,38.3 55.83,38.91 SHIF_2.12 | 55.22,37.85 55.22,32.66 55.07,32.51 52.93,32.51 52.78,32.66 52.78,34.04 52.48,34.34 51.71,34.34 49.89,32.51 47.14,32.51 46.99,32.66 46.99,34.04 42.57,38.46 42.57,38.91 SHIFT_3.12 | v58.42,37.85 v68.02,37.85 69.09,38.91 SHIFT_1.12 | 55.22,37.85 v55.52,37.85 | v86.16,19.71 86.16,16.05 CONTROL.11
SR_SCK  (via drill 0.35)
  Top 0.152: v54.61,37.85 v42.27,37.85 | v61.16,40.13 60.55,40.74 v55.83,40.74 | v67.11,40.13 v86.61,20.62
  Bottom 0.152: v42.27,37.85 42.27,38 41.35,38.91 SHIFT_3.11 | v54.61,37.85 SHIF_2.11 54.61,39.06 55.83,40.28 v55.83,40.74 | 66.95,39.98 66.8,40.13 v61.16,40.13 | 66.95,39.98 67.87,39.06 SHIFT_1.11 | v86.61,20.62 87.07,20.17 87.07,16.05 CONTROL.10 | 66.95,39.98 v67.11,40.13
SR_SER  (via drill 0.35)
  Top 0.152: v87.83,21.39 v71.83,37.39
  Bottom 0.152: v71.83,37.39 71.83,38.91 SHIFT_1.14 | v87.83,21.39 87.83,16.05 CONTROL.9
SS
  Bottom 0.152: CAN_SERIAL.16 86.31,12.55 86.31,13.16 84.02,15.44 84.02,15.9 CONTROL.14
TX  (via drill 0.35)
  Top 0.152: v94.08,44.09 94.08,45.16 95.15,46.23 PROGRAM.2
  Bottom 0.152: v94.08,44.09 94.08,33.73 87.22,26.87 87.22,24.74 CONTROL.31
VCC  (via drill 0.35)
  Top 0.152: C6.1 28.7,44.4 28.7,41.96 29.92,40.74 R20.2 30.07,40.59 v38.46,40.59 38.91,40.13 v47.75,40.13 v60.25,40.13 60.25,38.76 63.45,35.56 63.45,34.34 65.58,32.21 68.94,32.21 v82.35,18.8 v89.66,11.48 90.42,10.72 | 90.42,10.72 v94.54,6.6 | 90.42,10.72 98.04,18.34 98.04,18.95 95.3,21.69 95.3,34.19 POWER.1
  Bottom 0.152: SHIFT_3.16 47.75,39.06 v47.75,40.13 47.75,48.36 48.97,49.58 50.04,49.58 53.24,46.38 53.24,39.06 SHIF_2.10 | SHIFT_1.10 66.65,39.06 65.89,39.83 64.97,39.83 64.21,39.06 61.01,39.06 SHIF_2.16 60.86,39.06 60.86,39.52 v60.25,40.13 | v38.46,40.59 39.98,39.06 SHIFT_3.10 | 84.94,28.24 84.63,28.24 81.74,25.35 81.74,18.8 | 84.94,28.24 85.7,28.24 R21.1 | 81.74,18.8 81.28,18.34 80.82,18.34 CONTROL.18 | 84.94,42.88 78.23,42.88 74.42,39.06 SHIFT_1.16 | 84.94,42.88 86.92,42.88 C1.1 | 84.94,42.88 84.94,28.24 | v94.54,6.6 94.54,4.93 CAN_INTERFACE.3 | v89.66,11.48 88.9,12.24 CAN_SERIAL.18 88.9,16.66 88.44,17.12 88.44,18.64 88.9,19.1 89.36,19.1 CONTROL.6 89.51,19.25 89.97,19.25 90.27,19.56 90.27,20.32 89.97,20.62 89.51,20.62 CONTROL.4 | v82.35,18.8 81.74,18.8

### Text on the board
tSilk: M4
_tsilk: Design By Michael Greer / WURacing Electronics 2018
_bsilk: RST | TX | RX | SCK | MISO | MOSI | GND | VCC | CANH | CANL